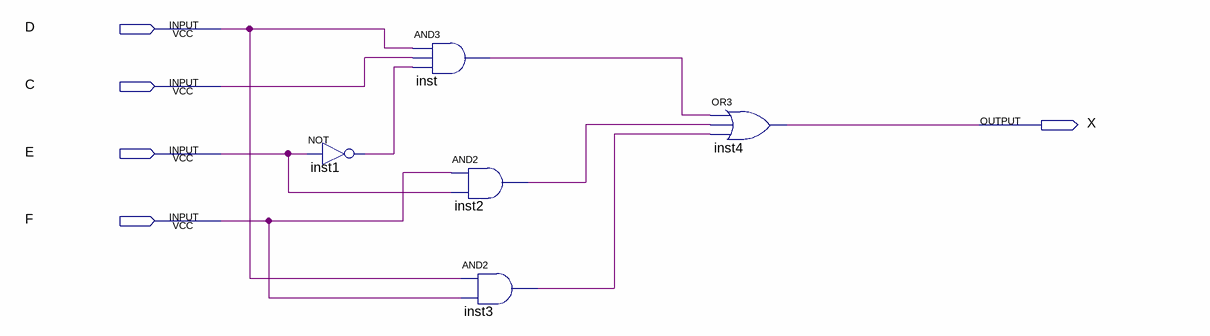
[diagram p0: schematic sheet]
// Quartus schematic KOMa1b0.bdf as structural Verilog: 5 symbols, 5 pins
module KOMa1b0 (
  input  D,
  input  C,
  input  E,
  input  F,
  output X
);

  wire inst1_out, inst2_out, inst3_out, inst_out;

  not inst1 (inst1_out, E);
  and inst (inst_out, D, C, inst1_out);
  and inst2 (inst2_out, F, E);
  and inst3 (inst3_out, D, F);
  or inst4 (X, inst_out, inst2_out, inst3_out);
endmodule
